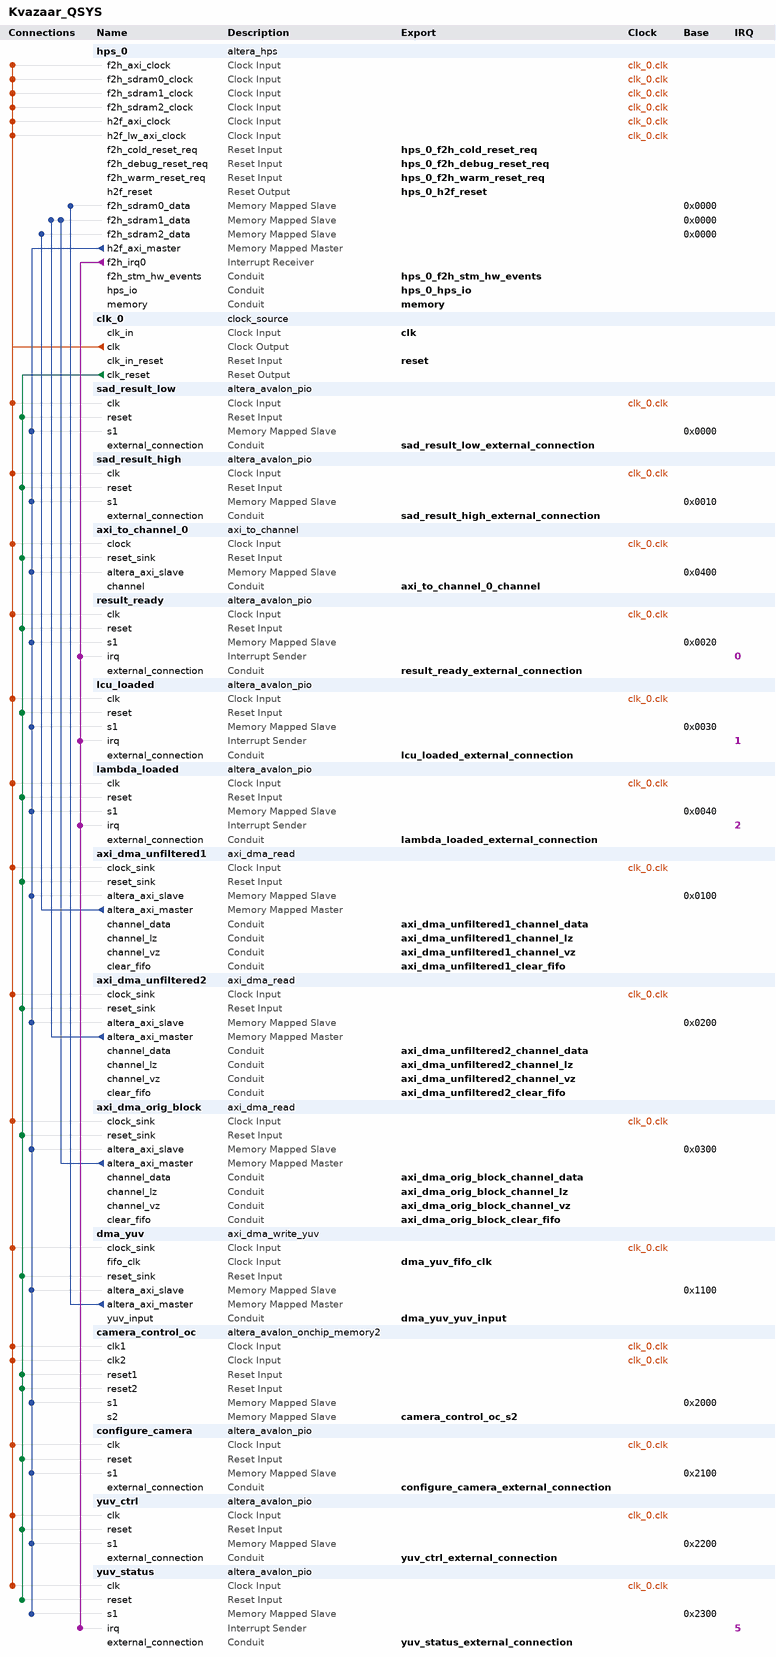
[diagram p0: system contents]
# Platform Designer (Qsys) system Kvazaar_QSYS, Cyclone V 5CSXFC6D6F31C6
# Parameters at their usual value, and those the tool derives, are not listed.
package require -exact qsys 16.0
create_system Kvazaar_QSYS
set_project_property DEVICE_FAMILY {Cyclone V}
set_project_property DEVICE 5CSXFC6D6F31C6

add_instance hps_0 altera_hps 16.0
set_instance_parameter_value hps_0 CAN0_Mode CAN
set_instance_parameter_value hps_0 CAN0_PinMuxing {HPS I/O Set 0}
set_instance_parameter_value hps_0 EMAC1_Mode RGMII
set_instance_parameter_value hps_0 EMAC1_PinMuxing {HPS I/O Set 0}
set_instance_parameter_value hps_0 F2SCLK_COLDRST_Enable true
set_instance_parameter_value hps_0 F2SCLK_DBGRST_Enable true
set_instance_parameter_value hps_0 F2SCLK_WARMRST_Enable true
set_instance_parameter_value hps_0 F2SDRAM_Type AXI-3,AXI-3,AXI-3
set_instance_parameter_value hps_0 F2SDRAM_Width 64,64,64
set_instance_parameter_value hps_0 F2SINTERRUPT_Enable true
set_instance_parameter_value hps_0 F2S_Width 2
set_instance_parameter_value hps_0 FPGA_PERIPHERAL_OUTPUT_CLOCK_FREQ_EMAC0_GTX_CLK 100
set_instance_parameter_value hps_0 FPGA_PERIPHERAL_OUTPUT_CLOCK_FREQ_EMAC0_MD_CLK 100.0
set_instance_parameter_value hps_0 FPGA_PERIPHERAL_OUTPUT_CLOCK_FREQ_EMAC1_GTX_CLK 100
set_instance_parameter_value hps_0 FPGA_PERIPHERAL_OUTPUT_CLOCK_FREQ_EMAC1_MD_CLK 100.0
set_instance_parameter_value hps_0 HPS_PROTOCOL DDR3
set_instance_parameter_value hps_0 I2C0_Mode I2C
set_instance_parameter_value hps_0 I2C0_PinMuxing {HPS I/O Set 1}
set_instance_parameter_value hps_0 I2C1_Mode N/A
set_instance_parameter_value hps_0 I2C1_PinMuxing Unused
set_instance_parameter_value hps_0 LWH2F_Enable true
set_instance_parameter_value hps_0 MEM_BANKADDR_WIDTH 3
set_instance_parameter_value hps_0 MEM_CLK_FREQ 400.0
set_instance_parameter_value hps_0 MEM_COL_ADDR_WIDTH 10
set_instance_parameter_value hps_0 MEM_DQ_WIDTH 40
set_instance_parameter_value hps_0 MEM_DRV_STR RZQ/6
set_instance_parameter_value hps_0 MEM_ROW_ADDR_WIDTH 15
set_instance_parameter_value hps_0 MEM_RTT_NOM RZQ/6
set_instance_parameter_value hps_0 MEM_RTT_WR {Dynamic ODT off}
set_instance_parameter_value hps_0 MEM_TCL 7
set_instance_parameter_value hps_0 MEM_TFAW_NS 30.0
set_instance_parameter_value hps_0 MEM_TRAS_NS 35.0
set_instance_parameter_value hps_0 MEM_TRCD_NS 13.75
set_instance_parameter_value hps_0 MEM_TRFC_NS 260.0
set_instance_parameter_value hps_0 MEM_TRP_NS 13.75
set_instance_parameter_value hps_0 MEM_TRRD_NS 10.0
set_instance_parameter_value hps_0 MEM_TRTP_NS 10.0
set_instance_parameter_value hps_0 MEM_VENDOR JEDEC
set_instance_parameter_value hps_0 MEM_WTCL 6
set_instance_parameter_value hps_0 QSPI_Mode {1 SS}
set_instance_parameter_value hps_0 QSPI_PinMuxing {HPS I/O Set 0}
set_instance_parameter_value hps_0 REF_CLK_FREQ 25.0
set_instance_parameter_value hps_0 S2FCLK_USER2CLK 5
set_instance_parameter_value hps_0 S2F_Width 2
set_instance_parameter_value hps_0 SDIO_Mode {4-bit Data}
set_instance_parameter_value hps_0 SDIO_PinMuxing {HPS I/O Set 0}
set_instance_parameter_value hps_0 SPIM0_Mode {Single Slave Select}
set_instance_parameter_value hps_0 SPIM0_PinMuxing {HPS I/O Set 0}
set_instance_parameter_value hps_0 SPIM1_Mode N/A
set_instance_parameter_value hps_0 SPIM1_PinMuxing Unused
set_instance_parameter_value hps_0 STM_Enable true
set_instance_parameter_value hps_0 TIMING_BOARD_AC_SKEW 0.02
set_instance_parameter_value hps_0 TIMING_BOARD_AC_TO_CK_SKEW 0.0
set_instance_parameter_value hps_0 TIMING_BOARD_DQ_TO_DQS_SKEW 0.0
set_instance_parameter_value hps_0 TIMING_BOARD_MAX_CK_DELAY 0.6
set_instance_parameter_value hps_0 TIMING_BOARD_MAX_DQS_DELAY 0.6
set_instance_parameter_value hps_0 TIMING_BOARD_SKEW_BETWEEN_DQS 0.02
set_instance_parameter_value hps_0 TIMING_BOARD_SKEW_CKDQS_DIMM_MAX 0.01
set_instance_parameter_value hps_0 TIMING_BOARD_SKEW_CKDQS_DIMM_MIN -0.01
set_instance_parameter_value hps_0 TIMING_BOARD_SKEW_WITHIN_DQS 0.02
set_instance_parameter_value hps_0 TIMING_TDH 45
set_instance_parameter_value hps_0 TIMING_TDQSCK 225
set_instance_parameter_value hps_0 TIMING_TDQSQ 100
set_instance_parameter_value hps_0 TIMING_TDQSS 0.27
set_instance_parameter_value hps_0 TIMING_TDS 10
set_instance_parameter_value hps_0 TIMING_TDSH 0.18
set_instance_parameter_value hps_0 TIMING_TDSS 0.18
set_instance_parameter_value hps_0 TIMING_TIH 120
set_instance_parameter_value hps_0 TIMING_TIS 170
set_instance_parameter_value hps_0 TIMING_TQSH 0.4
set_instance_parameter_value hps_0 TRACE_Mode HPS
set_instance_parameter_value hps_0 TRACE_PinMuxing {HPS I/O Set 0}
set_instance_parameter_value hps_0 UART0_Mode {No Flow Control}
set_instance_parameter_value hps_0 UART0_PinMuxing {HPS I/O Set 2}
set_instance_parameter_value hps_0 USB1_Mode SDR
set_instance_parameter_value hps_0 USB1_PinMuxing {HPS I/O Set 0}
set_instance_parameter_value hps_0 desired_cfg_clk_mhz 100.0
set_instance_parameter_value hps_0 desired_qspi_clk_mhz 400.0

add_instance clk_0 clock_source 16.0
set_instance_parameter_value clk_0 clockFrequency 75000000

add_instance sad_result_low altera_avalon_pio 16.0
set_instance_parameter_value sad_result_low captureEdge true
set_instance_parameter_value sad_result_low direction Input
set_instance_parameter_value sad_result_low width 32

add_instance sad_result_high altera_avalon_pio 16.0
set_instance_parameter_value sad_result_high captureEdge true
set_instance_parameter_value sad_result_high direction Input
set_instance_parameter_value sad_result_high width 32

add_instance axi_to_channel_0 axi_to_channel 1.0
set_instance_parameter_value axi_to_channel_0 channel_width_g 32
set_instance_parameter_value axi_to_channel_0 slave_address_width_g 8
set_instance_parameter_value axi_to_channel_0 slave_data_width_g 32
set_instance_parameter_value axi_to_channel_0 slave_id_width_g 12

add_instance result_ready altera_avalon_pio 16.0
set_instance_parameter_value result_ready captureEdge true
set_instance_parameter_value result_ready direction Input
set_instance_parameter_value result_ready generateIRQ true
set_instance_parameter_value result_ready irqType EDGE
set_instance_parameter_value result_ready width 2

add_instance lcu_loaded altera_avalon_pio 16.0
set_instance_parameter_value lcu_loaded captureEdge true
set_instance_parameter_value lcu_loaded direction Input
set_instance_parameter_value lcu_loaded generateIRQ true
set_instance_parameter_value lcu_loaded irqType EDGE
set_instance_parameter_value lcu_loaded width 1

add_instance lambda_loaded altera_avalon_pio 16.0
set_instance_parameter_value lambda_loaded captureEdge true
set_instance_parameter_value lambda_loaded direction Input
set_instance_parameter_value lambda_loaded generateIRQ true
set_instance_parameter_value lambda_loaded irqType EDGE
set_instance_parameter_value lambda_loaded width 1

add_instance axi_dma_unfiltered1 axi_dma_read 1.0
set_instance_parameter_value axi_dma_unfiltered1 channel_width_g 16
set_instance_parameter_value axi_dma_unfiltered1 fifo_size_g 8
set_instance_parameter_value axi_dma_unfiltered1 master_address_width_g 32
set_instance_parameter_value axi_dma_unfiltered1 master_data_width_g 64
set_instance_parameter_value axi_dma_unfiltered1 master_id_width_g 7
set_instance_parameter_value axi_dma_unfiltered1 read_id_g 4
set_instance_parameter_value axi_dma_unfiltered1 slave_address_width_g 8
set_instance_parameter_value axi_dma_unfiltered1 slave_data_width_g 32
set_instance_parameter_value axi_dma_unfiltered1 slave_id_width_g 12

add_instance axi_dma_unfiltered2 axi_dma_read 1.0
set_instance_parameter_value axi_dma_unfiltered2 channel_width_g 16
set_instance_parameter_value axi_dma_unfiltered2 fifo_size_g 8
set_instance_parameter_value axi_dma_unfiltered2 master_address_width_g 32
set_instance_parameter_value axi_dma_unfiltered2 master_data_width_g 64
set_instance_parameter_value axi_dma_unfiltered2 master_id_width_g 7
set_instance_parameter_value axi_dma_unfiltered2 read_id_g 5
set_instance_parameter_value axi_dma_unfiltered2 slave_address_width_g 8
set_instance_parameter_value axi_dma_unfiltered2 slave_data_width_g 32
set_instance_parameter_value axi_dma_unfiltered2 slave_id_width_g 12

add_instance axi_dma_orig_block axi_dma_read 1.0
set_instance_parameter_value axi_dma_orig_block channel_width_g 32
set_instance_parameter_value axi_dma_orig_block fifo_size_g 32
set_instance_parameter_value axi_dma_orig_block master_address_width_g 32
set_instance_parameter_value axi_dma_orig_block master_data_width_g 64
set_instance_parameter_value axi_dma_orig_block master_id_width_g 7
set_instance_parameter_value axi_dma_orig_block read_id_g 6
set_instance_parameter_value axi_dma_orig_block slave_address_width_g 8
set_instance_parameter_value axi_dma_orig_block slave_data_width_g 32
set_instance_parameter_value axi_dma_orig_block slave_id_width_g 12

add_instance dma_yuv axi_dma_write_yuv 1.0
set_instance_parameter_value dma_yuv channel_width_g 8
set_instance_parameter_value dma_yuv master_address_width_g 32
set_instance_parameter_value dma_yuv master_data_width_g 64
set_instance_parameter_value dma_yuv master_id_width_g 8
set_instance_parameter_value dma_yuv slave_address_width_g 8
set_instance_parameter_value dma_yuv slave_data_width_g 32
set_instance_parameter_value dma_yuv slave_id_width_g 12
set_instance_parameter_value dma_yuv u_fifo_size_g 512
set_instance_parameter_value dma_yuv v_fifo_size_g 512
set_instance_parameter_value dma_yuv write_id_g 0
set_instance_parameter_value dma_yuv y_fifo_size_g 512

add_instance camera_control_oc altera_avalon_onchip_memory2 16.0
set_instance_parameter_value camera_control_oc dataWidth 16
set_instance_parameter_value camera_control_oc dualPort true
set_instance_parameter_value camera_control_oc initMemContent true
set_instance_parameter_value camera_control_oc initializationFileName onchip_mem.hex
set_instance_parameter_value camera_control_oc memorySize 128
set_instance_parameter_value camera_control_oc resetrequest_enabled false

add_instance configure_camera altera_avalon_pio 16.0
set_instance_parameter_value configure_camera direction Output
set_instance_parameter_value configure_camera width 1

add_instance yuv_ctrl altera_avalon_pio 16.0
set_instance_parameter_value yuv_ctrl direction Output
set_instance_parameter_value yuv_ctrl width 4

add_instance yuv_status altera_avalon_pio 16.0
set_instance_parameter_value yuv_status captureEdge true
set_instance_parameter_value yuv_status direction Input
set_instance_parameter_value yuv_status generateIRQ true
set_instance_parameter_value yuv_status irqType EDGE
set_instance_parameter_value yuv_status width 1

# connections
add_connection clk_0.clk axi_dma_orig_block.clock_sink clock
add_connection clk_0.clk axi_dma_unfiltered1.clock_sink clock
add_connection clk_0.clk axi_dma_unfiltered2.clock_sink clock
add_connection clk_0.clk axi_to_channel_0.clock clock
add_connection clk_0.clk camera_control_oc.clk1 clock
add_connection clk_0.clk camera_control_oc.clk2 clock
add_connection clk_0.clk configure_camera.clk clock
add_connection clk_0.clk dma_yuv.clock_sink clock
add_connection clk_0.clk hps_0.f2h_axi_clock clock
add_connection clk_0.clk hps_0.f2h_sdram0_clock clock
add_connection clk_0.clk hps_0.f2h_sdram1_clock clock
add_connection clk_0.clk hps_0.f2h_sdram2_clock clock
add_connection clk_0.clk hps_0.h2f_axi_clock clock
add_connection clk_0.clk hps_0.h2f_lw_axi_clock clock
add_connection clk_0.clk lambda_loaded.clk clock
add_connection clk_0.clk lcu_loaded.clk clock
add_connection clk_0.clk result_ready.clk clock
add_connection clk_0.clk sad_result_high.clk clock
add_connection clk_0.clk sad_result_low.clk clock
add_connection clk_0.clk yuv_ctrl.clk clock
add_connection clk_0.clk yuv_status.clk clock
add_connection clk_0.clk_reset axi_dma_orig_block.reset_sink reset
add_connection clk_0.clk_reset axi_dma_unfiltered1.reset_sink reset
add_connection clk_0.clk_reset axi_dma_unfiltered2.reset_sink reset
add_connection clk_0.clk_reset axi_to_channel_0.reset_sink reset
add_connection clk_0.clk_reset camera_control_oc.reset1 reset
add_connection clk_0.clk_reset camera_control_oc.reset2 reset
add_connection clk_0.clk_reset configure_camera.reset reset
add_connection clk_0.clk_reset dma_yuv.reset_sink reset
add_connection clk_0.clk_reset lambda_loaded.reset reset
add_connection clk_0.clk_reset lcu_loaded.reset reset
add_connection clk_0.clk_reset result_ready.reset reset
add_connection clk_0.clk_reset sad_result_high.reset reset
add_connection clk_0.clk_reset sad_result_low.reset reset
add_connection clk_0.clk_reset yuv_ctrl.reset reset
add_connection clk_0.clk_reset yuv_status.reset reset
add_connection axi_dma_orig_block.altera_axi_master hps_0.f2h_sdram1_data avalon
set_connection_parameter_value axi_dma_orig_block.altera_axi_master/hps_0.f2h_sdram1_data baseAddress 0x0000
add_connection axi_dma_unfiltered1.altera_axi_master hps_0.f2h_sdram2_data avalon
set_connection_parameter_value axi_dma_unfiltered1.altera_axi_master/hps_0.f2h_sdram2_data baseAddress 0x0000
add_connection axi_dma_unfiltered2.altera_axi_master hps_0.f2h_sdram1_data avalon
set_connection_parameter_value axi_dma_unfiltered2.altera_axi_master/hps_0.f2h_sdram1_data baseAddress 0x0000
add_connection dma_yuv.altera_axi_master hps_0.f2h_sdram0_data avalon
set_connection_parameter_value dma_yuv.altera_axi_master/hps_0.f2h_sdram0_data baseAddress 0x0000
add_connection hps_0.h2f_axi_master axi_dma_orig_block.altera_axi_slave avalon
set_connection_parameter_value hps_0.h2f_axi_master/axi_dma_orig_block.altera_axi_slave baseAddress 0x0300
add_connection hps_0.h2f_axi_master axi_dma_unfiltered1.altera_axi_slave avalon
set_connection_parameter_value hps_0.h2f_axi_master/axi_dma_unfiltered1.altera_axi_slave baseAddress 0x0100
add_connection hps_0.h2f_axi_master axi_dma_unfiltered2.altera_axi_slave avalon
set_connection_parameter_value hps_0.h2f_axi_master/axi_dma_unfiltered2.altera_axi_slave baseAddress 0x0200
add_connection hps_0.h2f_axi_master axi_to_channel_0.altera_axi_slave avalon
set_connection_parameter_value hps_0.h2f_axi_master/axi_to_channel_0.altera_axi_slave baseAddress 0x0400
add_connection hps_0.h2f_axi_master camera_control_oc.s1 avalon
set_connection_parameter_value hps_0.h2f_axi_master/camera_control_oc.s1 baseAddress 0x2000
add_connection hps_0.h2f_axi_master configure_camera.s1 avalon
set_connection_parameter_value hps_0.h2f_axi_master/configure_camera.s1 baseAddress 0x2100
add_connection hps_0.h2f_axi_master dma_yuv.altera_axi_slave avalon
set_connection_parameter_value hps_0.h2f_axi_master/dma_yuv.altera_axi_slave baseAddress 0x1100
add_connection hps_0.h2f_axi_master lambda_loaded.s1 avalon
set_connection_parameter_value hps_0.h2f_axi_master/lambda_loaded.s1 baseAddress 0x0040
add_connection hps_0.h2f_axi_master lcu_loaded.s1 avalon
set_connection_parameter_value hps_0.h2f_axi_master/lcu_loaded.s1 baseAddress 0x0030
add_connection hps_0.h2f_axi_master result_ready.s1 avalon
set_connection_parameter_value hps_0.h2f_axi_master/result_ready.s1 baseAddress 0x0020
add_connection hps_0.h2f_axi_master sad_result_high.s1 avalon
set_connection_parameter_value hps_0.h2f_axi_master/sad_result_high.s1 baseAddress 0x0010
add_connection hps_0.h2f_axi_master sad_result_low.s1 avalon
set_connection_parameter_value hps_0.h2f_axi_master/sad_result_low.s1 baseAddress 0x0000
add_connection hps_0.h2f_axi_master yuv_ctrl.s1 avalon
set_connection_parameter_value hps_0.h2f_axi_master/yuv_ctrl.s1 baseAddress 0x2200
add_connection hps_0.h2f_axi_master yuv_status.s1 avalon
set_connection_parameter_value hps_0.h2f_axi_master/yuv_status.s1 baseAddress 0x2300
add_connection hps_0.f2h_irq0 lambda_loaded.irq interrupt
set_connection_parameter_value hps_0.f2h_irq0/lambda_loaded.irq irqNumber 2
add_connection hps_0.f2h_irq0 lcu_loaded.irq interrupt
set_connection_parameter_value hps_0.f2h_irq0/lcu_loaded.irq irqNumber 1
add_connection hps_0.f2h_irq0 result_ready.irq interrupt
set_connection_parameter_value hps_0.f2h_irq0/result_ready.irq irqNumber 0
add_connection hps_0.f2h_irq0 yuv_status.irq interrupt
set_connection_parameter_value hps_0.f2h_irq0/yuv_status.irq irqNumber 5

# exported interfaces
add_interface axi_dma_orig_block_channel_data conduit end
set_interface_property axi_dma_orig_block_channel_data EXPORT_OF axi_dma_orig_block.channel_data
add_interface axi_dma_orig_block_channel_lz conduit end
set_interface_property axi_dma_orig_block_channel_lz EXPORT_OF axi_dma_orig_block.channel_lz
add_interface axi_dma_orig_block_channel_vz conduit end
set_interface_property axi_dma_orig_block_channel_vz EXPORT_OF axi_dma_orig_block.channel_vz
add_interface axi_dma_orig_block_clear_fifo conduit end
set_interface_property axi_dma_orig_block_clear_fifo EXPORT_OF axi_dma_orig_block.clear_fifo
add_interface axi_dma_unfiltered1_channel_data conduit end
set_interface_property axi_dma_unfiltered1_channel_data EXPORT_OF axi_dma_unfiltered1.channel_data
add_interface axi_dma_unfiltered1_channel_lz conduit end
set_interface_property axi_dma_unfiltered1_channel_lz EXPORT_OF axi_dma_unfiltered1.channel_lz
add_interface axi_dma_unfiltered1_channel_vz conduit end
set_interface_property axi_dma_unfiltered1_channel_vz EXPORT_OF axi_dma_unfiltered1.channel_vz
add_interface axi_dma_unfiltered1_clear_fifo conduit end
set_interface_property axi_dma_unfiltered1_clear_fifo EXPORT_OF axi_dma_unfiltered1.clear_fifo
add_interface axi_dma_unfiltered2_channel_data conduit end
set_interface_property axi_dma_unfiltered2_channel_data EXPORT_OF axi_dma_unfiltered2.channel_data
add_interface axi_dma_unfiltered2_channel_lz conduit end
set_interface_property axi_dma_unfiltered2_channel_lz EXPORT_OF axi_dma_unfiltered2.channel_lz
add_interface axi_dma_unfiltered2_channel_vz conduit end
set_interface_property axi_dma_unfiltered2_channel_vz EXPORT_OF axi_dma_unfiltered2.channel_vz
add_interface axi_dma_unfiltered2_clear_fifo conduit end
set_interface_property axi_dma_unfiltered2_clear_fifo EXPORT_OF axi_dma_unfiltered2.clear_fifo
add_interface axi_to_channel_0_channel conduit end
set_interface_property axi_to_channel_0_channel EXPORT_OF axi_to_channel_0.channel
add_interface camera_control_oc_s2 avalon slave
set_interface_property camera_control_oc_s2 EXPORT_OF camera_control_oc.s2
add_interface clk clock sink
set_interface_property clk EXPORT_OF clk_0.clk_in
add_interface configure_camera_external_connection conduit end
set_interface_property configure_camera_external_connection EXPORT_OF configure_camera.external_connection
add_interface dma_yuv_fifo_clk clock sink
set_interface_property dma_yuv_fifo_clk EXPORT_OF dma_yuv.fifo_clk
add_interface dma_yuv_yuv_input conduit end
set_interface_property dma_yuv_yuv_input EXPORT_OF dma_yuv.yuv_input
add_interface hps_0_f2h_cold_reset_req reset sink
set_interface_property hps_0_f2h_cold_reset_req EXPORT_OF hps_0.f2h_cold_reset_req
add_interface hps_0_f2h_debug_reset_req reset sink
set_interface_property hps_0_f2h_debug_reset_req EXPORT_OF hps_0.f2h_debug_reset_req
add_interface hps_0_f2h_stm_hw_events conduit end
set_interface_property hps_0_f2h_stm_hw_events EXPORT_OF hps_0.f2h_stm_hw_events
add_interface hps_0_f2h_warm_reset_req reset sink
set_interface_property hps_0_f2h_warm_reset_req EXPORT_OF hps_0.f2h_warm_reset_req
add_interface hps_0_h2f_reset reset source
set_interface_property hps_0_h2f_reset EXPORT_OF hps_0.h2f_reset
add_interface hps_0_hps_io conduit end
set_interface_property hps_0_hps_io EXPORT_OF hps_0.hps_io
add_interface lambda_loaded_external_connection conduit end
set_interface_property lambda_loaded_external_connection EXPORT_OF lambda_loaded.external_connection
add_interface lcu_loaded_external_connection conduit end
set_interface_property lcu_loaded_external_connection EXPORT_OF lcu_loaded.external_connection
add_interface memory conduit end
set_interface_property memory EXPORT_OF hps_0.memory
add_interface reset reset sink
set_interface_property reset EXPORT_OF clk_0.clk_in_reset
add_interface result_ready_external_connection conduit end
set_interface_property result_ready_external_connection EXPORT_OF result_ready.external_connection
add_interface sad_result_high_external_connection conduit end
set_interface_property sad_result_high_external_connection EXPORT_OF sad_result_high.external_connection
add_interface sad_result_low_external_connection conduit end
set_interface_property sad_result_low_external_connection EXPORT_OF sad_result_low.external_connection
add_interface yuv_ctrl_external_connection conduit end
set_interface_property yuv_ctrl_external_connection EXPORT_OF yuv_ctrl.external_connection
add_interface yuv_status_external_connection conduit end
set_interface_property yuv_status_external_connection EXPORT_OF yuv_status.external_connection

set_interconnect_requirement {$system} qsys_mm.clockCrossingAdapter HANDSHAKE
set_interconnect_requirement {$system} qsys_mm.insertDefaultSlave false
set_interconnect_requirement {$system} qsys_mm.maxAdditionalLatency 0
set_interconnect_requirement hps_only_master.master qsys_mm.security SECURE

save_system Kvazaar_QSYS.qsys
